# EAGLE design ESP32-SolorCharge (EAGLE 9.6.2)
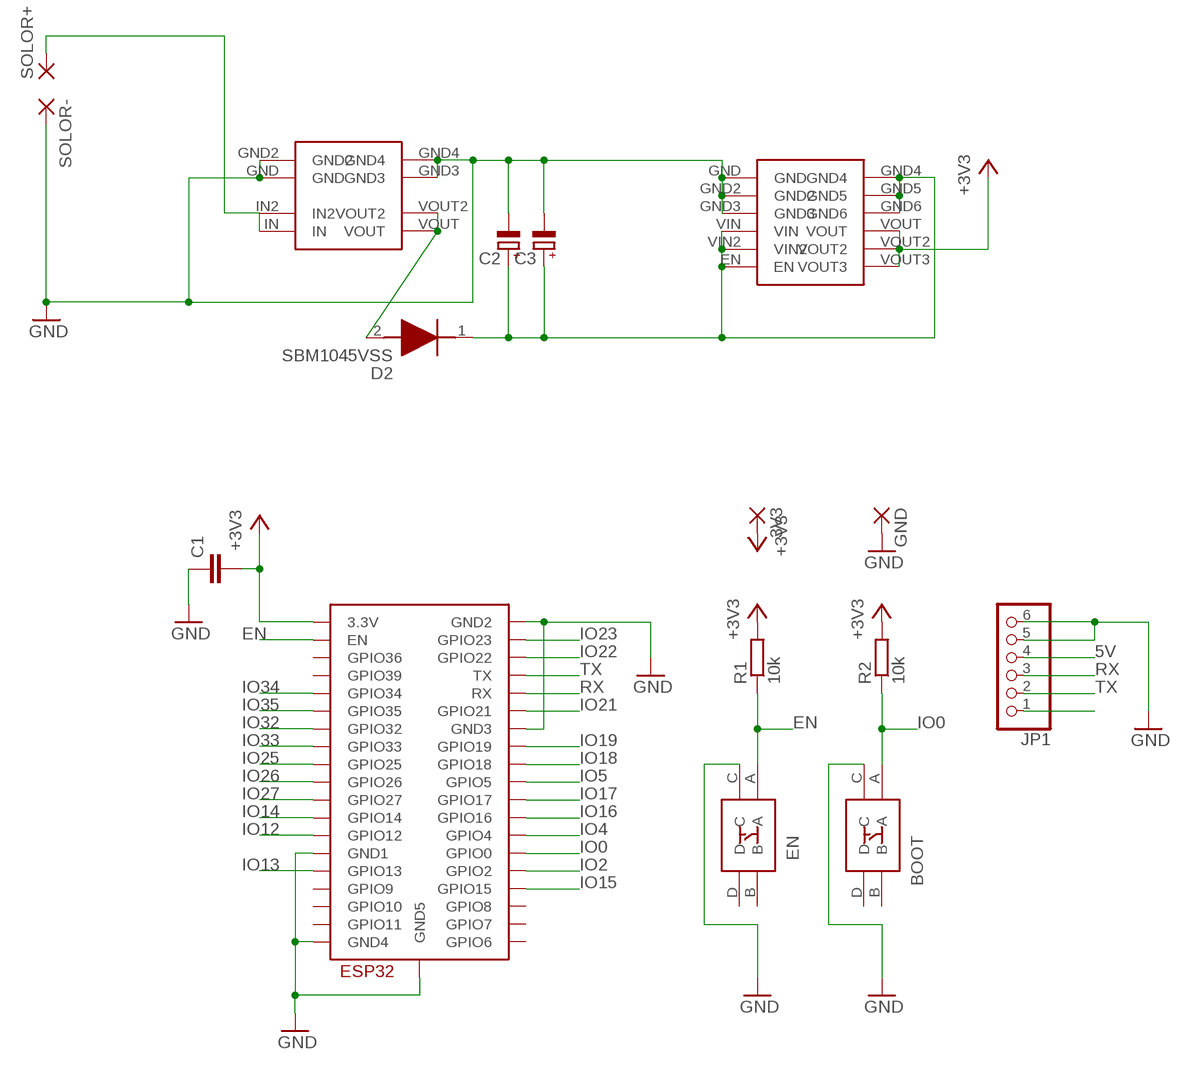
[diagram p0: schematic, sheet 1]

## Parts
3V3  2,54/1,0  [2,54/1,0]
BOOT  TS-06104  [TS06104]
C1  C-EU025-025X050  [C025-025X050]
C2  CPOL-EUE7.5-16  [E7,5-16]
C3  CPOL-EUE7.5-16  [E7,5-16]
D2  SBM1045VSS  [DIOAD2855W130L835D505]
EN  TS-06104  [TS06104]
GND  2,54/1,0  [2,54/1,0]
JP1  PINHD-1X6  [1X06]
R1  10k  R-EU_R0603  [R0603]
R2  10k  R-EU_R0603  [R0603]
SOLOR+  2,54/1,0  [2,54/1,0]
SOLOR-  2,54/1,0  [2,54/1,0]
U$1  ESP32-WROOM  [ESP32-WROOM]
U$2  TPS63070  [TPS63070]
U$3  TPS63020  [TPS63020]

## Nets
5V: JP1.4
+3V3: 3V3.1(P) C1.2 R1.2 R2.2 U$1.3V3(3.3V) U$3.VOUT U$3.VOUT2 U$3.VOUT3
EN: EN.A R1.1 U$1.EN
GND: BOOT.C C1.1 C2.- C3.- EN.C GND.1(P) JP1.5 JP1.6 SOLOR-.1(P) U$1.GND1 U$1.GND2 U$1.GND3 U$1.GND4 U$1.GND5 U$2.GND U$2.GND2 U$2.GND3 U$2.GND4 U$3.GND U$3.GND2 U$3.GND3
IO0: BOOT.A R2.1 U$1.IO0(GPIO0)
IO2: U$1.IO2(GPIO2)
IO4: U$1.IO4(GPIO4)
IO5: U$1.IO5(GPIO5)
IO12: U$1.IO12(GPIO12)
IO13: U$1.IO13(GPIO13)
IO14: U$1.IO14(GPIO14)
IO15: U$1.IO15(GPIO15)
IO16: U$1.IO16(GPIO16)
IO17: U$1.IO17(GPIO17)
IO18: U$1.IO18(GPIO18)
IO19: U$1.IO19(GPIO19)
IO21: U$1.IO21(GPIO21)
IO22: U$1.IO22(GPIO22)
IO23: U$1.IO23(GPIO23)
IO25: U$1.IO25(GPIO25)
IO26: U$1.IO26(GPIO26)
IO27: U$1.IO27(GPIO27)
IO32: U$1.IO32(GPIO32)
IO33: U$1.IO33(GPIO33)
IO34: U$1.IO34(GPIO34)
IO35: U$1.IO35(GPIO35)
N$3: D2.2(A) U$2.VOUT U$2.VOUT2
N$4: JP1.1
N$5: C2.+ C3.+ D2.1(K) U$3.EN U$3.GND4 U$3.GND5 U$3.GND6 U$3.VIN U$3.VIN2
N$6: SOLOR+.1(P) U$2.IN U$2.IN2
RX: JP1.3 U$1.RX
TX: JP1.2 U$1.TX
Unconnected: BOOT.B BOOT.D EN.B EN.D U$1.CLK(GPIO6) U$1.CMD(GPIO11) U$1.SD0(GPIO7) U$1.SD1(GPIO8) U$1.SD2(GPIO9) U$1.SD3(GPIO10) U$1.SENSOR_VN(GPIO39) U$1.SENSOR_VP(GPIO36)

## Library data of the parts
3V3 GND SOLOR+ SOLOR- = MyLibrary:2,54/1,0: THROUGH-HOLE PAD
BOOT EN = TS-06104:TS-06104: Tactile Switch Source: Datasheet <https://akizukidenshi.com/download/ds/jinbeili/TS-06104.pdf>; DESCRIPTION: Tactile Switch; HEIGHT: 4.35mm; MANUFACTURER_NAME: Jinbeili; MANUFACTURER_PART_NUMBER: TS-06104
C1 = rcl:C-EU: CAPACITOR, European symbol; SPICEPREFIX: C
C2 C3 = rcl:CPOL-EU: POLARIZED CAPACITOR, European symbol; SPICEPREFIX: C
D2 = SBM1045VSS:SBM1045VSS: Low VF Schottky Rectifier Source: Datasheet <http://akizukidenshi.com/download/ds/panjit/sbm1045vss.pdf>; DESCRIPTION: Low VF Schottky Rectifier; HEIGHT: mm; MANUFACTURER_NAME: PANJIT; MANUFACTURER_PART_NUMBER: SBM1045VSS
JP1 = pinhead:PINHD-1X6: PIN HEADER
R1 R2 = rcl:R-EU_: RESISTOR, European symbol; SPICEPREFIX: R
U$1 = ESP32Module:ESP32-WROOM
U$2 = TPS63070:TPS63070
U$3 = TPS63020:TPS63020

## Board
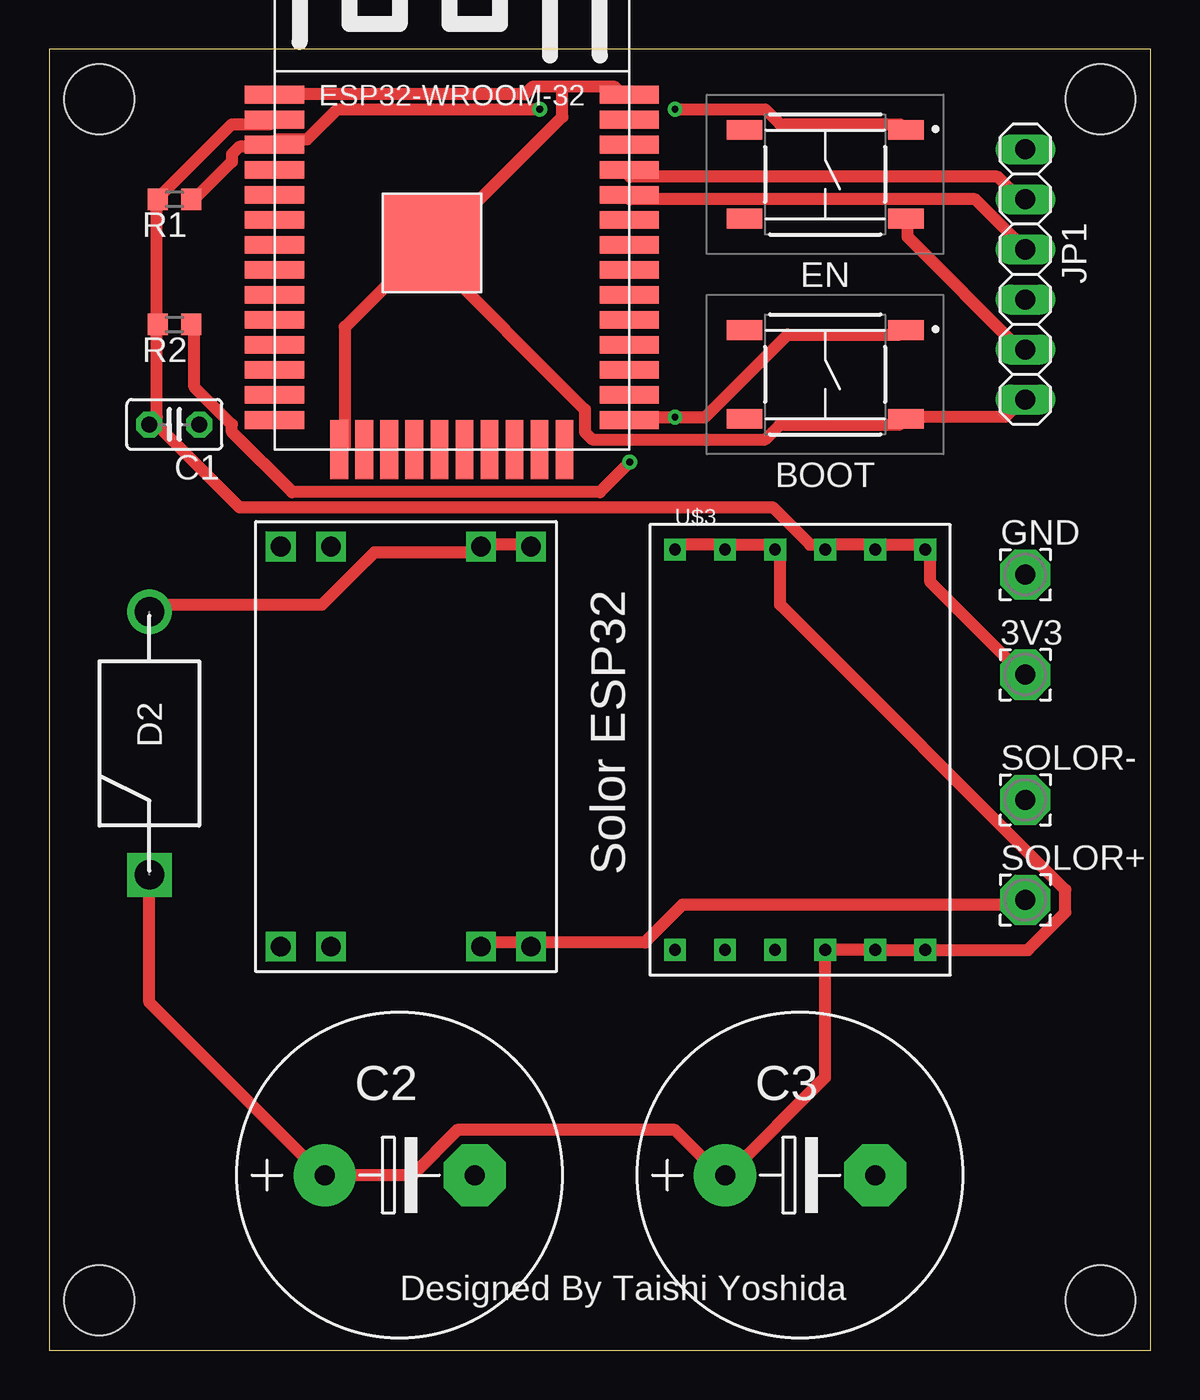
[diagram p1: board, top side]
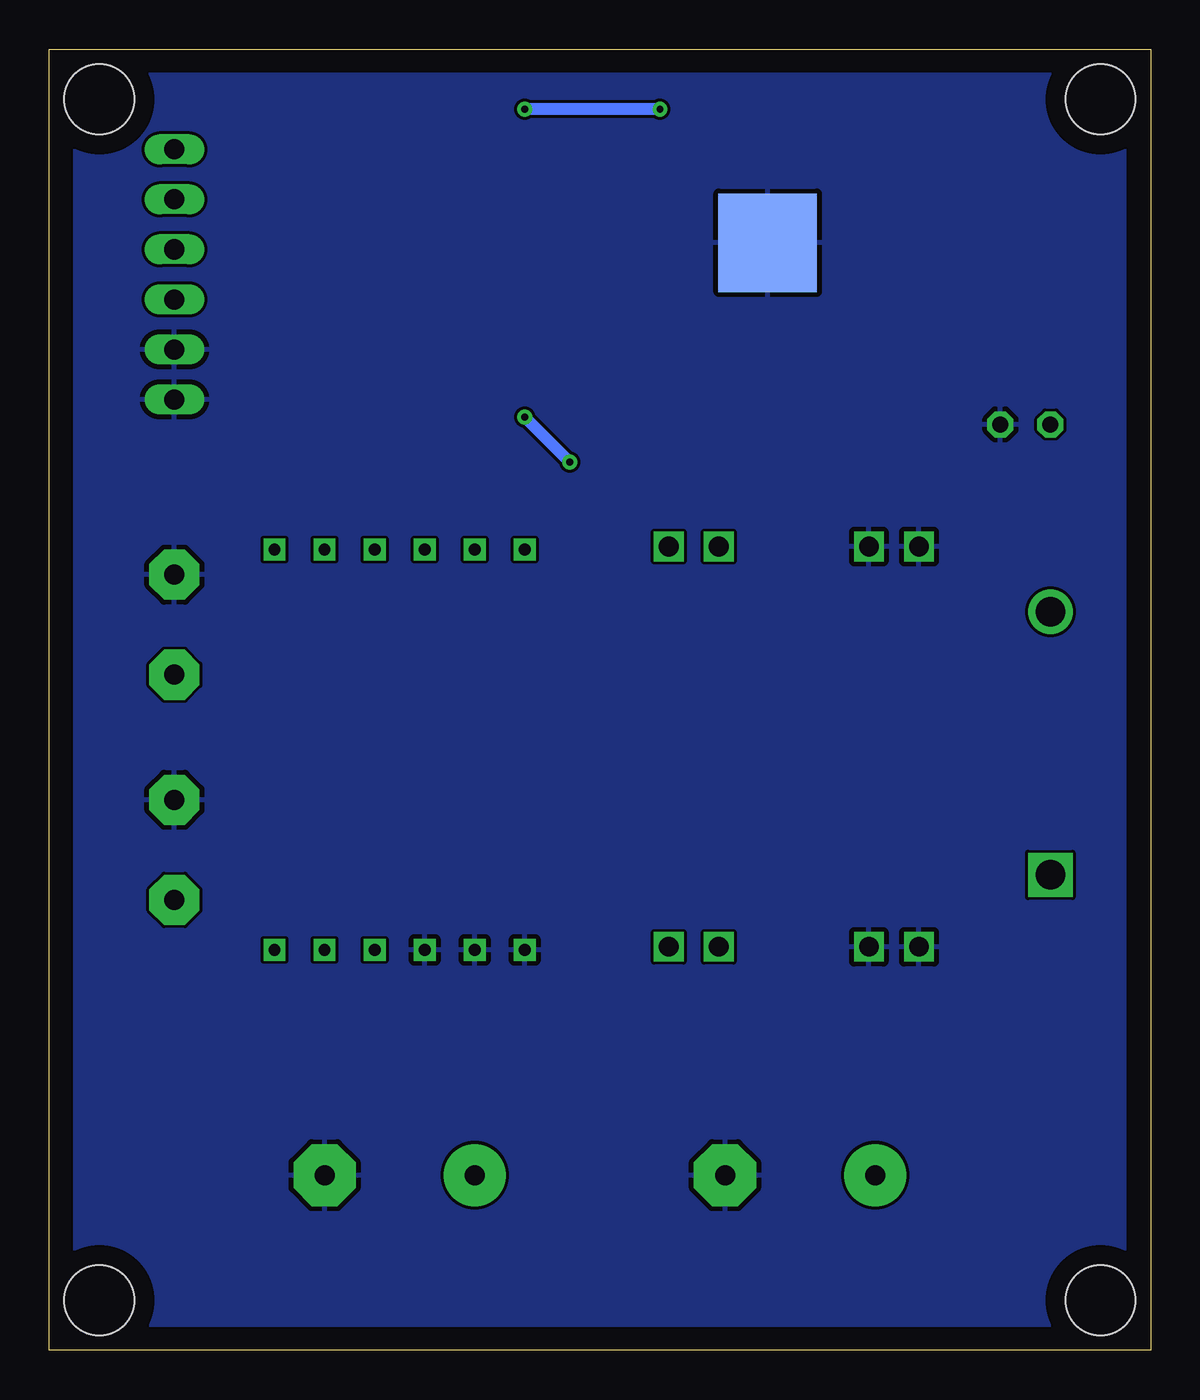
[diagram p2: board, bottom side, seen from below]

Size 55.88 x 66.04 mm. Coordinates in mm from the lower left corner, seen from the top.
Outline: 0,0 55.88,0 55.88,66.04 0,66.03 0,0
Copper layers (1*16): Top 0.035mm / dielectric 1.5mm / Bottom 0.035mm
Design rules "default *": minimum track width 24mil, minimum drill 0.35mm, track to track 6mil, track to pad 6mil, pad to pad 6mil, via to via 6mil, smd to smd 6mil, copper to edge 40mil, drill to drill 6mil, minimum pad ring 10mil, minimum via ring 8mil, stop-mask expansion 4mil, vias tented up to drill 0mil, thermal gap 10mil
Holes 3.54 mm at 2.54,63.5 53.34,63.5 53.34,2.54 2.54,2.54

### Footprints (pad centres in the part's own frame; a part is rotated, then mirrored left to right if it is on the bottom)
2,54/1,0 = drill 1.016 pad 2.54 octagon: 1 0,0
TS06104 = smd 1.8 x 1: A 4.1,2.25; B -4.1,2.25; C 4.1,-2.25; D -4.1,-2.25
C025-025X050 = drill 0.813 octagon: 1 -1.27,0; 2 1.27,0
E7,5-16 = drill 1.016 pad 3.15: + -3.81,0 | drill 1.016 pad 3.15 octagon: - 3.81,0
DIOAD2855W130L835D505 = drill 1.5 pad 2.25 square: 1 3.81,0 | drill 1.5 pad 2.25: 2 17.17,0
1X06 = drill 1.016 long: 1 -6.35,0; 2 -3.81,0; 3 -1.27,0; 4 1.27,0; 5 3.81,0; 6 6.35,0
R0603 = smd 1 x 1.1: 1 -0.85,0; 2 0.85,0
ESP32-WROOM = smd 3 x 0.9: 3V3 0,16.74; EN 0,15.47; GND1 0,18.01; GND3 18,18.01; IO0 18,1.5; IO4 18,2.77; IO5 18,6.58; IO12 0,1.5; IO14 0,2.77; IO16 18,4.04; IO17 18,5.31; IO18 18,7.85; IO19 18,9.12; IO21 18,11.66; IO22 18,15.47; IO23 18,16.74; IO25 0,6.58; IO26 0,5.31; IO27 0,4.04; IO32 0,9.12; IO33 0,7.85; IO34 0,11.66; IO35 0,10.39; NC 18,10.39; RX 18,12.93; SENSOR_VN 0,12.93; SENSOR_VP 0,14.2; TX 18,14.2 | smd 0.9 x 3: CLK 9.635,0; CMD 8.365,0; GND2 3.285,0; IO2 14.715,0; IO13 4.555,0; IO15 13.445,0; SD0 10.905,0; SD1 12.175,0; SD2 5.825,0; SD3 7.095,0 | smd 5 x 5: GND4 8,10.5 | smd 5 x 5 bottom: GND5 8,10.5
TPS63070 = drill 1 square: GND 1.27,-19.05; GND2 3.81,-19.05; GND3 1.27,1.27; GND4 3.81,1.27; IN 13.97,-19.05; IN2 11.43,-19.05; VOUT 11.43,1.27; VOUT2 13.97,1.27
TPS63020 = drill 0.6 square: EN 13.97,-21.59; GND 1.27,-21.59; GND2 3.81,-21.59; GND3 6.35,-21.59; GND4 1.27,-1.27; GND5 3.81,-1.27; GND6 6.35,-1.27; VIN 8.89,-21.59; VIN2 11.43,-21.59; VOUT 8.89,-1.27; VOUT2 11.43,-1.27; VOUT3 13.97,-1.27

### Placement (x,y rotation side)
3V3  49.53,34.29 0 top
BOOT  39.37,49.53 0 top
C1  6.35,46.99 180 top
C2  17.78,8.89 0 top
C3  38.1,8.89 0 top
D2  5.08,20.32 90 top
EN  39.37,59.69 0 top
GND  49.53,39.37 0 top
JP1  49.53,54.61 270 top
R1  6.35,58.42 180 top
R2  6.35,52.07 180 top
SOLOR+  49.53,22.86 0 top
SOLOR-  49.53,27.94 0 top
U$1  11.43,45.72 0 top
U$2  10.48,39.53 0 top
U$3  30.48,41.91 0 top

### Tracks (layer width: path | path; a pad name or v marks a point on that pad's centre or on a via)
+3V3
  Top 0.61: 39.37,40.89 41.66,40.89 U$3.VOUT2 42.04,40.89 44.32,40.89 U$3.VOUT3 44.7,40.51 44.7,38.99 49.28,34.42 3V3.1 | 5.46,58.42 5.46,52.32 R2.2 5.46,51.94 5.46,47.37 C1.2 5.46,46.99 9.65,42.8 36.7,42.8 38.61,40.89 39.37,40.89 | 5.46,58.42 9.27,62.23 11.18,62.23 U$1.3V3 | 5.46,58.42 R1.2 | 39.37,40.89 U$3.VOUT
EN  (via drill 0.35)
  Top 0.61: R1.1 7.37,58.42 9.27,60.33 9.27,60.71 9.65,61.09 11.18,61.09 U$1.EN 11.56,61.47 13.08,61.47 14.61,62.99 v24.89,62.99 | v31.75,62.99 36.32,62.99 37.08,62.23 43.18,62.23 EN.A
  Bottom 0.61: v24.89,62.99 v31.75,62.99
GND
  Top 0.61: 26.03,64.14 28.7,64.14 29.08,63.75 U$1.GND3 | 26.03,64.14 24.51,64.14 24.13,63.75 11.56,63.75 U$1.GND1 | JP1.6 49.28,48.13 48.51,47.37 43.56,47.37 BOOT.C 43.18,46.99 37.08,46.99 36.32,46.23 27.56,46.23 27.18,46.61 27.18,47.75 19.18,55.75 U$1.GND4 | EN.C 43.56,57.28 43.56,56.52 49.28,50.8 JP1.5 | U$1.GND2 14.99,45.85 14.99,51.94 19.18,56.13 U$1.GND4 | 26.03,64.14 26.03,62.61 19.56,56.13 U$1.GND4
  pour Bottom: 1.27,64.77 54.61,64.77 54.61,1.27 1.27,1.27
IO0  (via drill 0.35)
  Top 0.61: v29.46,45.09 27.94,43.56 12.32,43.56 9.27,46.61 9.27,46.99 7.37,48.9 7.37,51.94 R2.1 | U$1.IO0 29.46,47.37 v31.75,47.37 33.27,47.37 37.46,51.56 43.18,51.56 BOOT.A
  Bottom 0.61: v31.75,47.37 v29.46,45.09
N$3
  Top 0.61: U$2.VOUT2 24.13,40.89 22.23,40.89 U$2.VOUT 21.84,40.51 16.51,40.51 13.84,37.85 5.08,37.85 D2.2
N$5
  Top 0.61: D2.1 5.08,17.65 13.84,8.89 C2.+ 18.41,8.89 20.7,11.18 31.75,11.18 34.04,8.89 C3.+ 34.42,8.89 39.37,13.84 U$3.VIN U$3.VIN2 U$3.EN 49.66,20.32 51.56,22.23 51.56,23.37 37.08,37.85 37.08,40.51 U$3.GND6 36.7,40.89 34.42,40.89 U$3.GND5 34.04,40.89 31.75,40.89 U$3.GND4
N$6
  Top 0.61: U$2.IN2 22.23,20.7 24.13,20.7 U$2.IN 24.51,20.7 30.23,20.7 32.13,22.61 49.28,22.61 SOLOR+.1
RX
  Top 0.61: JP1.3 46.99,58.42 29.46,58.42 U$1.RX
TX
  Top 0.61: U$1.TX 29.46,59.56 48.13,59.56 49.28,58.42 JP1.2

### Text on the board
tNames: Solor ESP32 | Designed By Taishi Yoshida